# EAGLE design RH044.2 (EAGLE 7.1.0)
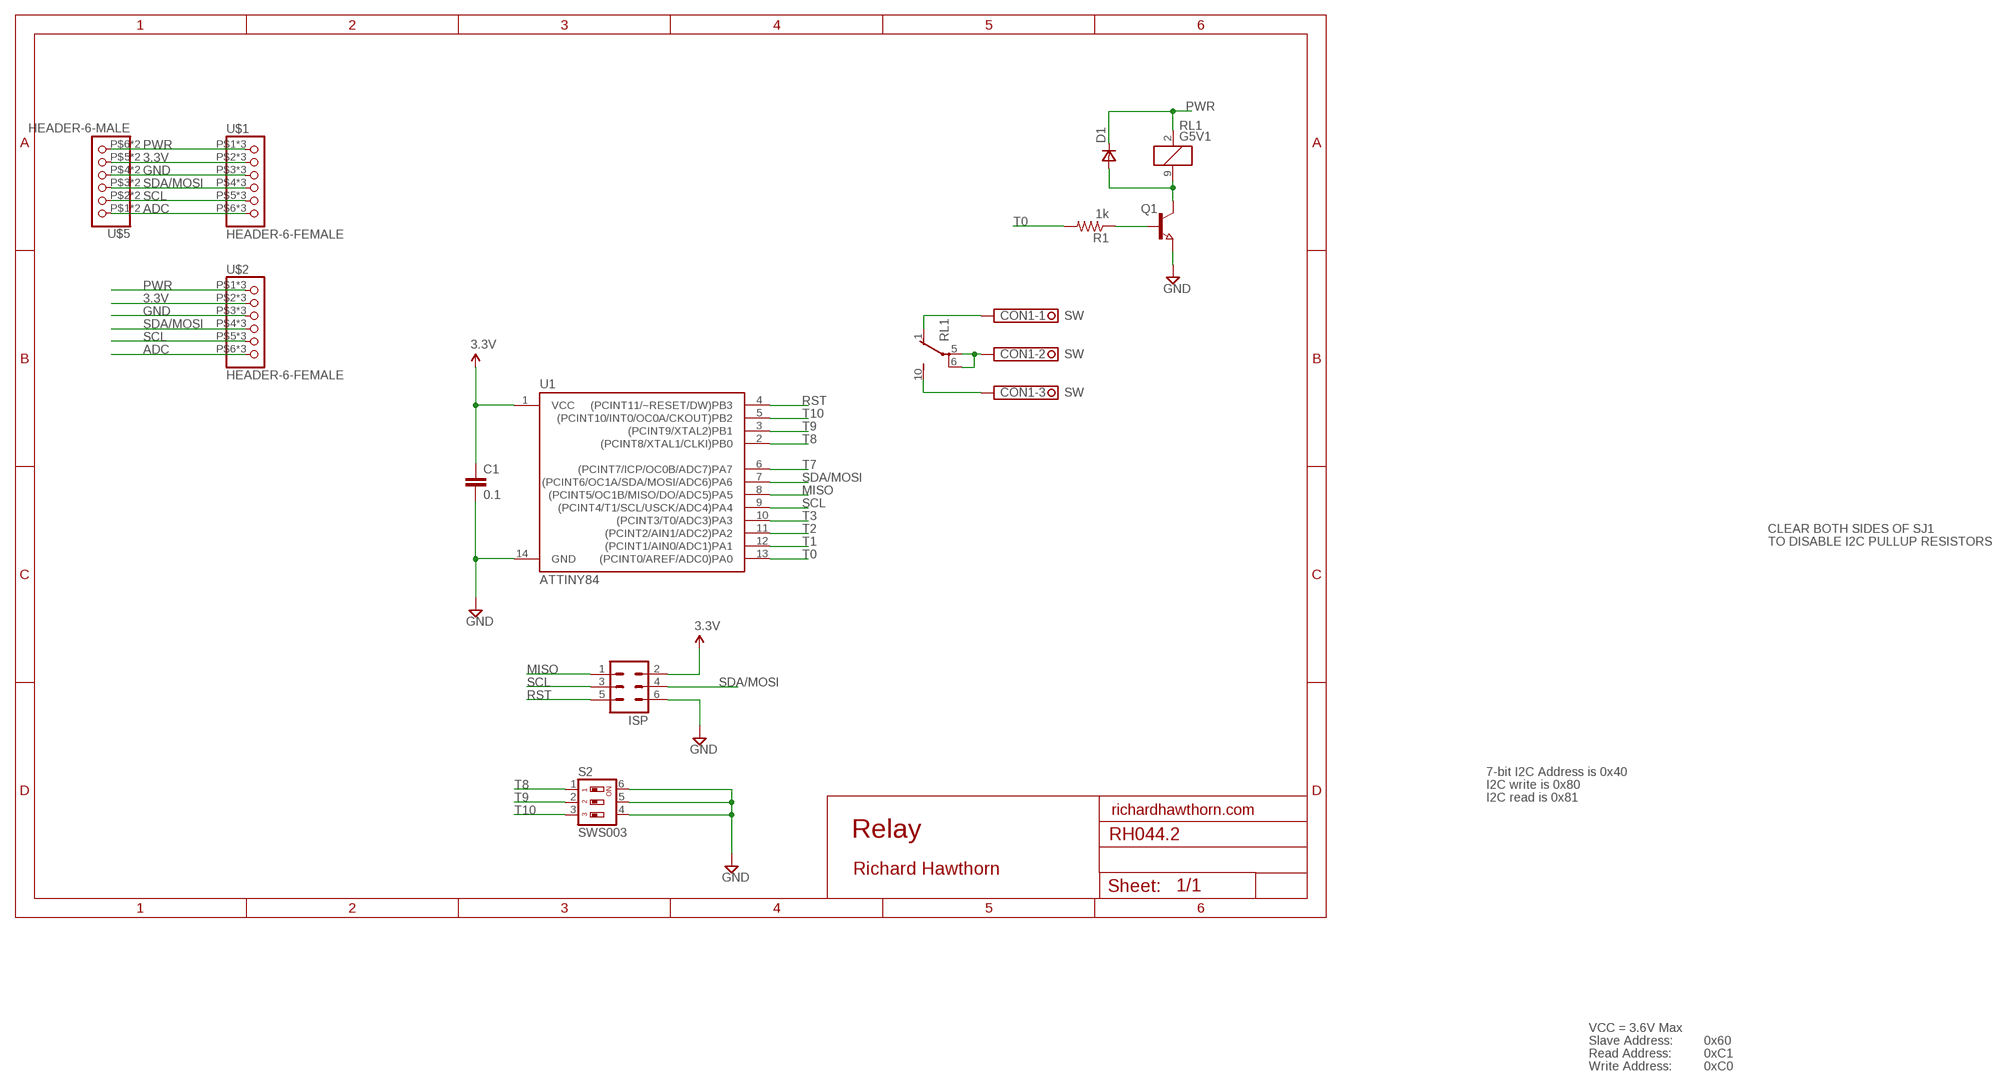
[diagram p0: schematic, sheet 1]

## Parts
C1  0.1  CAP0603-CAP  [0603-CAP]
CON1  SW  1751251  [1751251]
D1  VAR2SOT23  [SOT-23]
ISP  MA03-2  [MA03-2]
Q1  NPN-TRANSISTOR_SOT23  [SOT23]
R1  1k  RESISTOR0603-RES  [0603-RES]
RL1  G5V1  [G5V1]
S2  SWS003  [SMS-003]
U1  ATTINY84  [SO14]
U$1  HEADER-6-FEMALE  [2MMHEADER6]
U$2  HEADER-6-FEMALE  [2MMHEADER6]
U$5  HEADER-6-MALE  [2MMHEADERPIN6]

## Nets
3.3V: C1.1 ISP.2 U1.1(VCC) U$1.P$2 U$1.P$10 U$1.P$18 U$2.P$2 U$2.P$10 U$2.P$18 U$5.P$5 U$5.P$13
ADC: U$1.P$6 U$1.P$14 U$1.P$22 U$2.P$6 U$2.P$14 U$2.P$22 U$5.P$1 U$5.P$9
COM: CON1.2 RL1.5(2:P) RL1.6(2:P)
GND [power]: C1.2 ISP.6 Q1.2(E) S2.4 S2.5 S2.6 U1.14(GND) U$1.P$3 U$1.P$11 U$1.P$19 U$2.P$3 U$2.P$11 U$2.P$19 U$5.P$4 U$5.P$12
MISO: ISP.1 U1.8((PCINT5/OC1B/MISO/DO/ADC5)PA5)
N$30: Q1.1(B) R1.1
N$31: D1.3(A) Q1.3(C) RL1.9
NC: CON1.1 RL1.1(2:O)
NO: CON1.3 RL1.10(2:S)
PWR [power]: D1.1(C) RL1.2 U$1.P$1 U$1.P$9 U$1.P$17 U$2.P$1 U$2.P$9 U$2.P$17 U$5.P$6 U$5.P$14
RST: ISP.5 U1.4((PCINT11/~RESET/DW)PB3)
SCL: ISP.3 U1.9((PCINT4/T1/SCL/USCK/ADC4)PA4) U$1.P$5 U$1.P$13 U$1.P$21 U$2.P$5 U$2.P$13 U$2.P$21 U$5.P$2 U$5.P$10
SDA/MOSI: ISP.4 U1.7((PCINT6/OC1A/SDA/MOSI/ADC6)PA6) U$1.P$4 U$1.P$12 U$1.P$20 U$2.P$4 U$2.P$12 U$2.P$20 U$5.P$3 U$5.P$11
T0: R1.2 U1.13((PCINT0/AREF/ADC0)PA0)
T1: U1.12((PCINT1/AIN0/ADC1)PA1)
T2: U1.11((PCINT2/AIN1/ADC2)PA2)
T3: U1.10((PCINT3/T0/ADC3)PA3)
T7: U1.6((PCINT7/ICP/OC0B/ADC7)PA7)
T8: S2.1 U1.2((PCINT8/XTAL1/CLKI)PB0)
T9: S2.2 U1.3((PCINT9/XTAL2)PB1)
T10: S2.3 U1.5((PCINT10/INT0/OC0A/CKOUT)PB2)

## Notes on the sheet
- CLEAR BOTH SIDES OF SJ1
- TO DISABLE I2C PULLUP RESISTORS
- 7-bit I2C Address is 0x40
- I2C write is 0x80
- I2C read is 0x81
- richardhawthorn.com
- Relay
- Richard Hawthorn
- VCC = 3.6V Max
- Slave Address: | 0x60
- Read Address: | 0xC1
- Write Address: | 0xC0

## Library data of the parts
C1 = LowPowerLab:CAP: Capacitor Standard 0603 ceramic capacitor, and 0.1" leaded capacitor.
CON1 = con-phoenix-350:1751251: MKDS 1/ 3-3,5 Printklemme Nennstrom: 10 A Bemessungsspannung: 160 V Raster: 3,5 mm Polzahl: 3 Montageart: Löten Anschlussart: Schraubanschluss Anschlussrichtung vom Leiter zur Platine: 0° Source: http://eshop.phoenixcontact.com .. 1751251.pdf; OC_FARNELL: unknown; OC_NEWARK: unknown
D1 = zetex:VAR2SOT23: DIODE; OC_FARNELL: unknown; OC_NEWARK: unknown
ISP = Richards:MA03-2: PIN HEADER; OC_FARNELL: unknown; OC_NEWARK: unknown
Q1 = semicon-smd-ipc:NPN-TRANSISTOR_: NPN TRANSISTOR
R1 = LowPowerLab:RESISTOR: Resistor Basic schematic elements and footprints for 0603, 1206, and PTH resistors.
RL1 = relay:G5V1: RELAY 1 x switch, 0.5 A/125 V AC, 1 A/24 V DC , Omron; MPN: G5V-1-DC24; OC_FARNELL: 9949593; OC_NEWARK: 36M6377
S2 = smd-special:SWS003: SMD Dip Switch 3 pol.
U1 = SparkFun-DigitalIC:ATTINY84: Atmel 14-pin 2/4/8kB flash uC
U$1 U$2 = Richards:HEADER-6-FEMALE
U$5 = Richards:HEADER-6-MALE

## Net classes
1 power: width 0.381 mm, clearance 0.254 mm
2 mains: width 3.048 mm

## Board
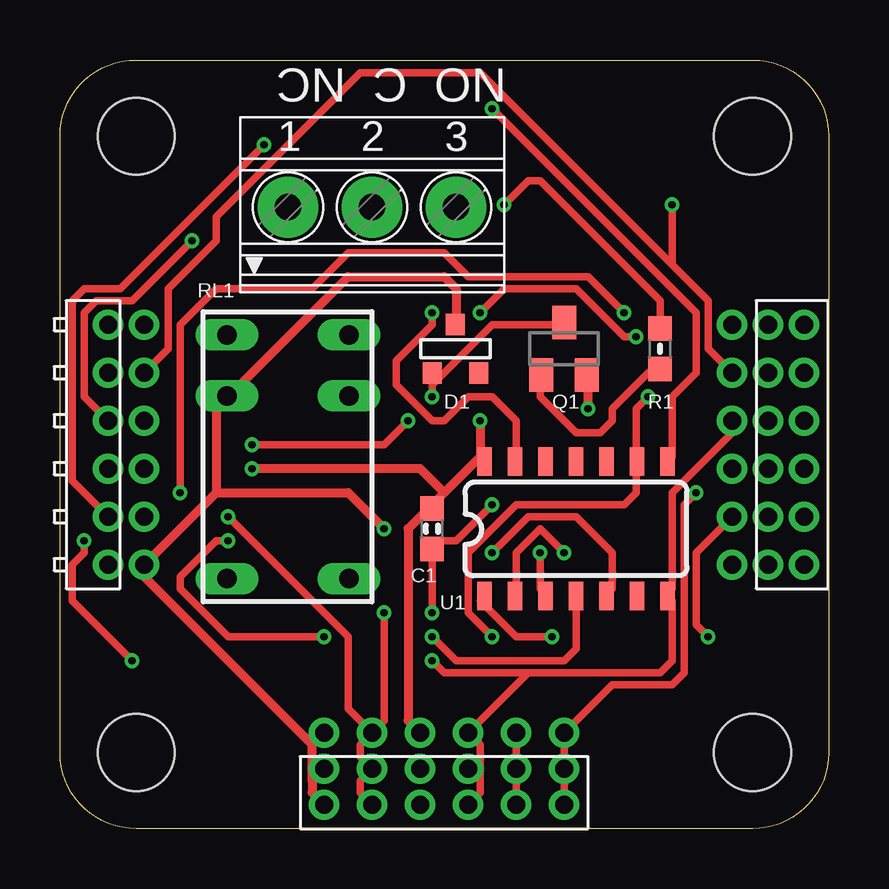
[diagram p1: board, top side]
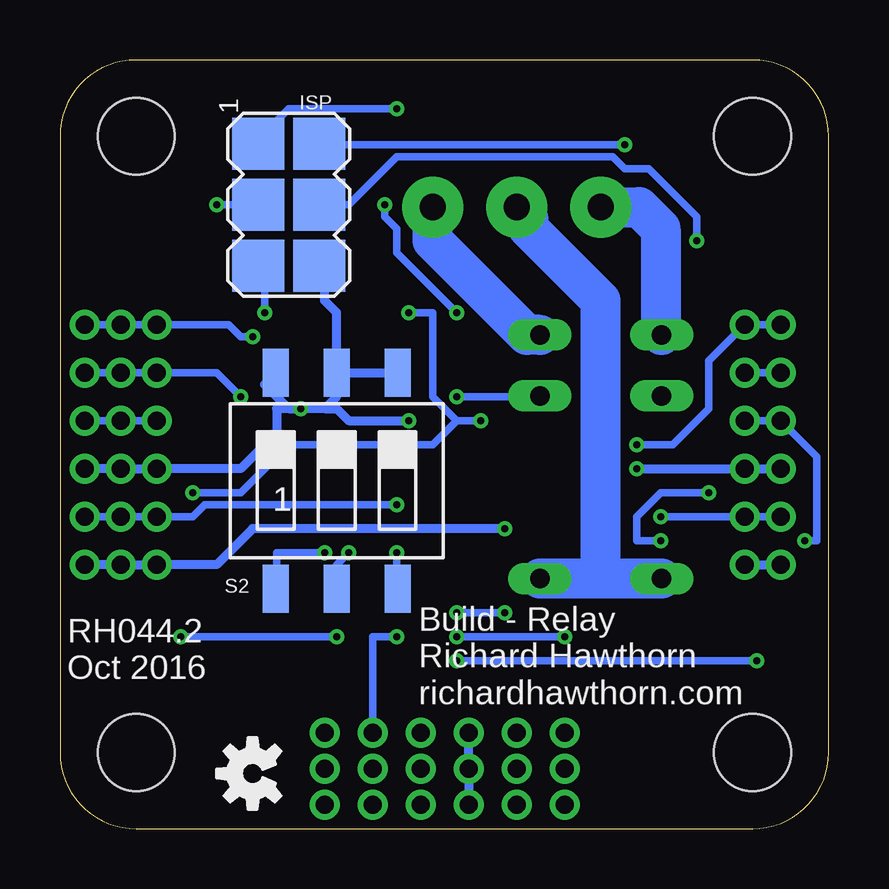
[diagram p2: board, bottom side, seen from below]

Size 32.03 x 32.03 mm. Coordinates in mm from the lower left corner, seen from the top.
Outline: 0,3.17 0,28.86 arc-90 3.17,32.03 28.86,32.03 arc-90 32.03,28.86 32.03,3.17 arc-90 28.86,0 3.17,0 arc-90 0,3.17
Copper layers (1*16): Top 0.035mm / dielectric 1.5mm / Bottom 0.035mm
Design rules "ITEADstudio_DRC *": minimum track width 12mil, minimum drill 12mil, track to track 6mil, track to pad 6mil, pad to pad 6mil, via to via 6mil, smd to smd 0mil, copper to edge 10mil, drill to drill 10mil, minimum pad ring 10mil, minimum via ring 6mil, stop-mask expansion 2mil, vias tented up to drill 100mil, thermal gap 15mil
Holes 3.2 mm at 3.17,3.17 28.86,3.17 3.17,28.86 28.86,28.86
tRestrict: area 0,0 to 5.7,5.7; area 26.3,0 to 32,5.7; area 26.3,26.3 to 32,32; area 0,26.3 to 5.7,32
bRestrict: area 0,26.3 to 5.7,32; area 26.3,26.3 to 32,32; area 26.3,0 to 32,5.7; area 0,0 to 5.7,5.7

### Footprints (pad centres in the part's own frame; a part is rotated, then mirrored left to right if it is on the bottom)
0603-CAP = smd 1.016 x 0.965: 1 -0.85,0; 2 0.85,0
1751251 = drill 1.1 pad 2.54: 1 -3.5,-0.1; 2 0,-0.1; 3 3.5,-0.1
SOT-23 = smd 0.787 x 0.889: 1 0.025,-1.016; 2 -0.94,1.016; 3 0.991,1.016
MA03-2 = smd 2.159 x 2.159: 1 -2.54,-1.27; 2 -2.54,1.27; 3 0,-1.27; 4 0,1.27; 5 2.54,-1.27; 6 2.54,1.27
SOT23 = smd 1 x 1.4: 1 -0.95,-1.1; 2 0.95,-1.1; 3 0,1.1
0603-RES = smd 1.016 x 0.965: 1 -0.85,0; 2 0.85,0
G5V1 = drill 0.813 long: 1 -5.08,-2.54; 2 -2.54,-2.54; 5 5.08,-2.54; 6 5.08,2.54; 9 -2.54,2.54; 10 -5.08,2.54
SMS-003 = smd 1.092 x 2.007: 1 -2.54,-4.496; 2 0,-4.496; 3 2.54,-4.496; 4 2.54,4.496; 5 0,4.496; 6 -2.54,4.496
SO14 = smd 0.6 x 1.2: 1 -3.81,-2.8; 2 -2.54,-2.8; 3 -1.27,-2.8; 4 0,-2.8; 5 1.27,-2.8; 6 2.54,-2.8; 7 3.81,-2.8; 8 3.81,2.8; 9 2.54,2.8; 10 1.27,2.8; 11 0,2.8; 12 -1.27,2.8; 13 -2.54,2.8; 14 -3.81,2.8
2MMHEADER6 = drill 0.75: P$1 1,5; P$2 1,3; P$3 1,1; P$4 1,-1; P$5 1,-3; P$6 1,-5; P$9 -0.5,5; P$10 -0.5,3; P$11 -0.5,1; P$12 -0.5,-1; P$13 -0.5,-3; P$14 -0.5,-5; P$17 -2,5; P$18 -2,3; P$19 -2,1; P$20 -2,-1; P$21 -2,-3; P$22 -2,-5
2MMHEADERPIN6 = drill 0.75: P$1 1,5; P$2 1,3; P$3 1,1; P$4 1,-1; P$5 1,-3; P$6 1,-5; P$9 -0.5,5; P$10 -0.5,3; P$11 -0.5,1; P$12 -0.5,-1; P$13 -0.5,-3; P$14 -0.5,-5

### Placement (x,y rotation side)
C1  15.5,12.5 90 top
CON1  13,26 0 top
D1  16.5,20 180 top
ISP  22.5,26 270 bottom
Q1  21,20 0 top
R1  25,20 90 top
RL1  9.5,15.5 270 top
S2  20.5,14.5 0 bottom
U1  21.5,12.5 0 top
U$1  16,3 90 top
U$2  29,16 180 top
U$3  [OSHW-LOGO-S]  24,2.3 90 bottom
U$5  2.5,16 0 top

### Tracks (layer width: path | path; a pad name or v marks a point on that pad's centre or on a via)
3.3V  (via drill 0.3)
  Top 0.305: U$1.P$18 12.5,1.5 12.5,2 U$1.P$10 12.5,3 12.5,3.5 U$1.P$2 | v15.5,9 C1.1 15.5,12 16.5,12 v18,13.5 | v13.5,9 13.5,4.5 U$1.P$2 | v20.5,8 19,8 17.5,9.5 U1.1 | v27,8 26.5,8.5 26.5,11.5 U$2.P$2 | v8.5,28.5 2.5,22.5 1,22.5 0.5,22 0.5,14.5 U$5.P$13 | U$1.P$2 12,5 12,8 v7,13
  Bottom 0.305: v13.5,9 v15.5,9 | v27,8 v20.5,8 | U$2.P$18 U$2.P$10 U$2.P$2 26.5,13 26,13.5 v18,13.5 | U$5.P$13 U$5.P$5 v7,13 | v8.5,28.5 21,28.5 ISP.2
ADC  (via drill 0.3)
  Top 0.305: U$1.P$22 U$1.P$14 U$1.P$6 23,6 25.5,6 26,6.5 26,13.5 v26.5,14 | v8,16 13.5,16 v14.5,17 | v17.5,21.5 18.5,22.5 21.5,22.5 23.5,20.5 v24,20.5
  Bottom 0.305: U$5.P$9 U$5.P$1 5,19.5 5,17.5 6.5,16 v8,16 | U$2.P$22 U$2.P$14 U$2.P$6 25,21 24.5,20.5 v24,20.5 | 15.5,17 v14.5,17 | 15.5,17 16.5,18 16.5,21.5 v17.5,21.5 | v26.5,14 24.5,14 22.5,16 16.5,16 15.5,17
COM
  Bottom 1.676: RL1.5 9.5,10.42 | 9.5,10.42 9.5,22 12.5,25 12.5,25.4 CON1.2 | 9.5,10.42 RL1.6
GND  (via drill 0.3)
  Top 0.381: 17.5,15.5 16,14 | 16,14 15.5,13.5 | v22,17.5 22,18.5 Q1.2 | v17.5,17 17.5,15.5 | 17.5,15.5 U1.14 | v8,15 15,15 16,14 | U$1.P$3 14.5,4.5 14.5,12.5 15.5,13.5 | 15.5,13.5 C1.2
  Bottom 0.381: U$2.P$19 U$2.P$11 U$2.P$3 24.5,15 23,16.5 23,17.5 22.5,17.5 | U$1.P$19 U$1.P$11 U$1.P$3 | U$5.P$12 U$5.P$4 v8,15 | 22.5,17.5 v22,17.5 21,17.5 | 22.5,17.5 23.5,18.5 S2.6 | S2.5 18,19 S2.4 | S2.5 20.5,21.5 21,22 21,23 ISP.6 | S2.5 20.5,18 21,17.5 | v17.5,17 20,17 20.5,17.5 21,17.5
MISO  (via drill 0.3)
  Top 0.305: v18,30 26.5,21.5 26.5,19 25.5,18 25.5,15.5 U1.8
  Bottom 0.305: v18,30 22.5,30 23.5,29 ISP.1
N$30
  Top 0.305: R1.1 25,19 24.5,19 23,17.5 23,17 22.5,16.5 21.5,16.5 20,18 20,18.5 Q1.1
N$31  (via drill 0.3)
  Top 0.305: v15.5,18 15.5,18.5 | 15.5,18.5 15.5,19 D1.3 | 15.5,18.5 18,21 21,21 Q1.3
  Bottom 0.305: v15.5,18 12.5,18 RL1.9
NC
  Bottom 1.676: CON1.1 7.9,25.9 7,25 7,20.62 RL1.1
NO
  Bottom 1.676: RL1.10 12.58,20.58 16.5,24.5 CON1.3
PWR  (via drill 0.3)
  Top 0.381: U$1.P$17 10.5,1.5 10.5,2 | U$1.P$9 10.5,2 | 10.5,3.5 U$1.P$1 | 10.5,2 10.5,3.5 | D1.1 16.5,21 16.5,22.5 16,23 12,23 7,18 RL1.2 6.5,18 6.5,14 | 6.5,14 U$5.P$6 3.5,10.5 10.5,3.5 | v13.5,12.5 12,14 6.5,14
  Bottom 0.381: U$2.P$17 U$2.P$9 U$2.P$1 25.5,11 24,12.5 v13.5,12.5 | U$5.P$6 U$5.P$14
RST  (via drill 0.3)
  Top 0.305: v23.5,21.5 22,23 17,23 16,24 12,24 10.5,22.5 6.5,22.5 5,21 v5,14 | v7,12 6.5,12 5,10.5 5,10 7,8 v11,8 | v15.5,8 16.5,7 21,7 21.5,7.5 U1.4
  Bottom 0.305: v23.5,21.5 23.5,23 ISP.5 | v5,14 7,14 8,13 8,12 v7,12 | v15.5,8 v11,8
SCL  (via drill 0.3)
  Top 0.305: U$1.P$21 U$1.P$13 U$1.P$5 | v24.5,18 24,17.5 24,15.5 U1.9 24,15 24,14 23.5,13.5 19,13.5 17,11.5 17,9 v18,8 | 25.5,23.5 v25.5,26 | 25.5,23.5 27,22 27,20 U$2.P$5 | U$5.P$2 4.5,20 4.5,22.5 6.5,24.5 6.5,25.5 12.5,31.5 17.5,31.5 25.5,23.5
  Bottom 0.305: U$5.P$2 U$5.P$10 | v24.5,18 25.5,19 U$2.P$5 U$2.P$13 U$2.P$21 | v25.5,26 ISP.3 | U$1.P$5 19,8 v18,8
SDA/MOSI  (via drill 0.3)
  Top 0.305: v5.5,24.5 3,22 1.5,22 1,21.5 1,18 U$5.P$11 | 17.5,3 17.5,3.5 U$1.P$4 19.5,6.5 | U$1.P$12 17.5,3 | U$1.P$20 17.5,1.5 17.5,3 | U$2.P$4 28,16.5 25.5,14 25.5,10 U1.7 25.5,9.5 25.5,7 25,6.5 19.5,6.5 | v1,12 1,11.5 0.5,11 0.5,9.5 v3,7 | v15.5,7 16,6.5 19.5,6.5
  Bottom 0.305: ISP.4 20,26 18,28 9,28 8.5,27.5 7.5,27.5 5.5,25.5 v5.5,24.5 | U$5.P$3 U$5.P$11 0.5,15.5 0.5,12 v1,12 | U$2.P$4 U$2.P$12 U$2.P$20 | v15.5,7 v3,7
T0  (via drill 0.3)
  Top 0.305: R1.2 25,22 20,27 19.5,27 v18.5,26 | v15.5,21.5 15.5,21 14,19.5 14,18.5 15.5,17 16,17 17,18 18,18 19,17 19,15.5 U1.13
  Bottom 0.305: v18.5,26 18.5,25.5 18,25 18,24 v15.5,21.5
T8  (via drill 0.3)
  Top 0.305: v21,11.5 20,12.5 19,11.5 19,10 U1.2
  Bottom 0.305: v21,11.5 23,11.5 23,10.5 S2.1
T9  (via drill 0.3)
  Top 0.305: v20,11.5 20,10 U1.3
  Bottom 0.305: v20,11.5 20.5,11 S2.2
T10  (via drill 0.3)
  Top 0.305: v18,11.5 19.5,13 21.5,13 23,11.5 23,10 U1.5
  Bottom 0.305: v18,11.5 18,10.5 S2.3

### Text on the board
tPlace: NO C NC
bPlace: RH044.2 / Oct 2016 | Build - Relay / Richard Hawthorn / richardhawthorn.com
tDocu: REG